# EAGLE schematic MAX31856_BREAKOUT_x4 (EAGLE 7.7.0)
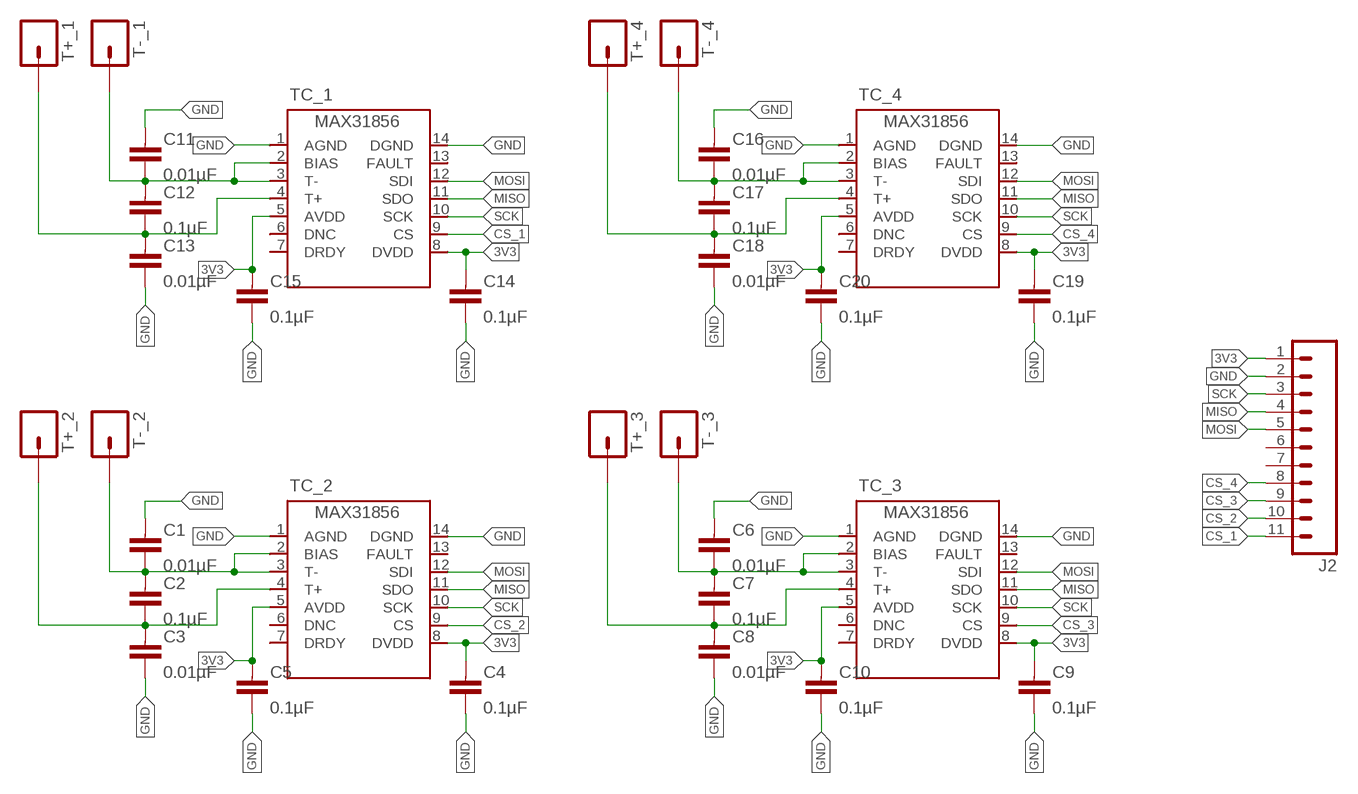
[diagram p0: schematic, sheet 1]

## Parts
C1  0.01µF  CAPACITOR0603-N  [C0603-N]
C2  0.1µF  CAPACITOR0603-N  [C0603-N]
C3  0.01µF  CAPACITOR0603-N  [C0603-N]
C4  0.1µF  CAPACITOR0603-N  [C0603-N]
C5  0.1µF  CAPACITOR0603-N  [C0603-N]
C6  0.01µF  CAPACITOR0603-N  [C0603-N]
C7  0.1µF  CAPACITOR0603-N  [C0603-N]
C8  0.01µF  CAPACITOR0603-N  [C0603-N]
C9  0.1µF  CAPACITOR0603-N  [C0603-N]
C10  0.1µF  CAPACITOR0603-N  [C0603-N]
C11  0.01µF  CAPACITOR0603-N  [C0603-N]
C12  0.1µF  CAPACITOR0603-N  [C0603-N]
C13  0.01µF  CAPACITOR0603-N  [C0603-N]
C14  0.1µF  CAPACITOR0603-N  [C0603-N]
C15  0.1µF  CAPACITOR0603-N  [C0603-N]
C16  0.01µF  CAPACITOR0603-N  [C0603-N]
C17  0.1µF  CAPACITOR0603-N  [C0603-N]
C18  0.01µF  CAPACITOR0603-N  [C0603-N]
C19  0.1µF  CAPACITOR0603-N  [C0603-N]
C20  0.1µF  CAPACITOR0603-N  [C0603-N]
J2  M11PTH  [1X11]
T+_1  M01SMD  [LUXEON-PAD]
T+_2  M01SMD  [LUXEON-PAD]
T+_3  M01SMD  [LUXEON-PAD]
T+_4  M01SMD  [LUXEON-PAD]
T-_1  M01SMD  [LUXEON-PAD]
T-_2  M01SMD  [LUXEON-PAD]
T-_3  M01SMD  [LUXEON-PAD]
T-_4  M01SMD  [LUXEON-PAD]
TC_1  MAX31856MUD+  [TSSOP14]
TC_2  MAX31856MUD+  [TSSOP14]
TC_3  MAX31856MUD+  [TSSOP14]
TC_4  MAX31856MUD+  [TSSOP14]

## Nets
3V3: C4.1 C5.1 C9.1 C10.1 C14.1 C15.1 C19.1 C20.1 J2.1 TC_1.5(AVDD) TC_1.8(DVDD) TC_2.5(AVDD) TC_2.8(DVDD) TC_3.5(AVDD) TC_3.8(DVDD) TC_4.5(AVDD) TC_4.8(DVDD)
CS_1: J2.11 TC_1.9(CS)
CS_2: J2.10 TC_2.9(CS)
CS_3: J2.9 TC_3.9(CS)
CS_4: J2.8 TC_4.9(CS)
GND: C1.1 C3.2 C4.2 C5.2 C6.1 C8.2 C9.2 C10.2 C11.1 C13.2 C14.2 C15.2 C16.1 C18.2 C19.2 C20.2 J2.2 TC_1.1(AGND) TC_1.14(DGND) TC_2.1(AGND) TC_2.14(DGND) TC_3.1(AGND) TC_3.14(DGND) TC_4.1(AGND) TC_4.14(DGND)
MISO: J2.4 TC_1.11(SDO) TC_2.11(SDO) TC_3.11(SDO) TC_4.11(SDO)
MOSI: J2.5 TC_1.12(SDI) TC_2.12(SDI) TC_3.12(SDI) TC_4.12(SDI)
N$1: C7.2 C8.1 T+_3.P$1 TC_3.4(T+)
N$2: C6.2 C7.1 T-_3.P$1 TC_3.2(BIAS) TC_3.3(T-)
N$3: C2.2 C3.1 T+_2.P$1 TC_2.4(T+)
N$4: C1.2 C2.1 T-_2.P$1 TC_2.2(BIAS) TC_2.3(T-)
N$5: C12.2 C13.1 T+_1.P$1 TC_1.4(T+)
N$6: C11.2 C12.1 T-_1.P$1 TC_1.2(BIAS) TC_1.3(T-)
N$7: C17.2 C18.1 T+_4.P$1 TC_4.4(T+)
N$8: C16.2 C17.1 T-_4.P$1 TC_4.2(BIAS) TC_4.3(T-)
SCK: J2.3 TC_1.10(SCK) TC_2.10(SCK) TC_3.10(SCK) TC_4.10(SCK)
Unconnected: J2.6 J2.7 TC_1.6(DNC) TC_1.7(DRDY) TC_1.13(FAULT) TC_2.6(DNC) TC_2.7(DRDY) TC_2.13(FAULT) TC_3.6(DNC) TC_3.7(DRDY) TC_3.13(FAULT) TC_4.6(DNC) TC_4.7(DRDY) TC_4.13(FAULT)

## Library data of the parts
C1-C20 = passives-7351:CAPACITOR
J2 = SparkFun-Connectors:M11: Header 11 Standard 11-pin 0.1" header. Use with straight break away headers (SKU : PRT-00116), right angle break away headers (PRT-00553), swiss pins (PRT-00743), machine pins (PRT-00117), and female headers (PRT-00115).
T+_1-T+_4 T-_1-T-_4 = SparkFun-Connectors:M01: Header 1 Standard 1-pin 0.1" header. Use with straight break away headers (SKU : PRT-00116), right angle break away headers (PRT-00553), swiss pins (PRT-00743), machine pins (PRT-00117), and female headers (PRT-00115). SMTSO-256-ET is a "flush mount" nut for a 4-40 screw. The older package used to be too tight, and did not allow it to sit properly thru the drill hit. The latest (0.165DIA) fits nice and snug.
TC_1-TC_4 = _my-parts:MAX31856MUD+